# Altium schematic sheet AMC_FMC_Carrier_block.SchDoc
size A4; DocumentNumber: 2; SheetNumber: 2; SheetTotal: 30
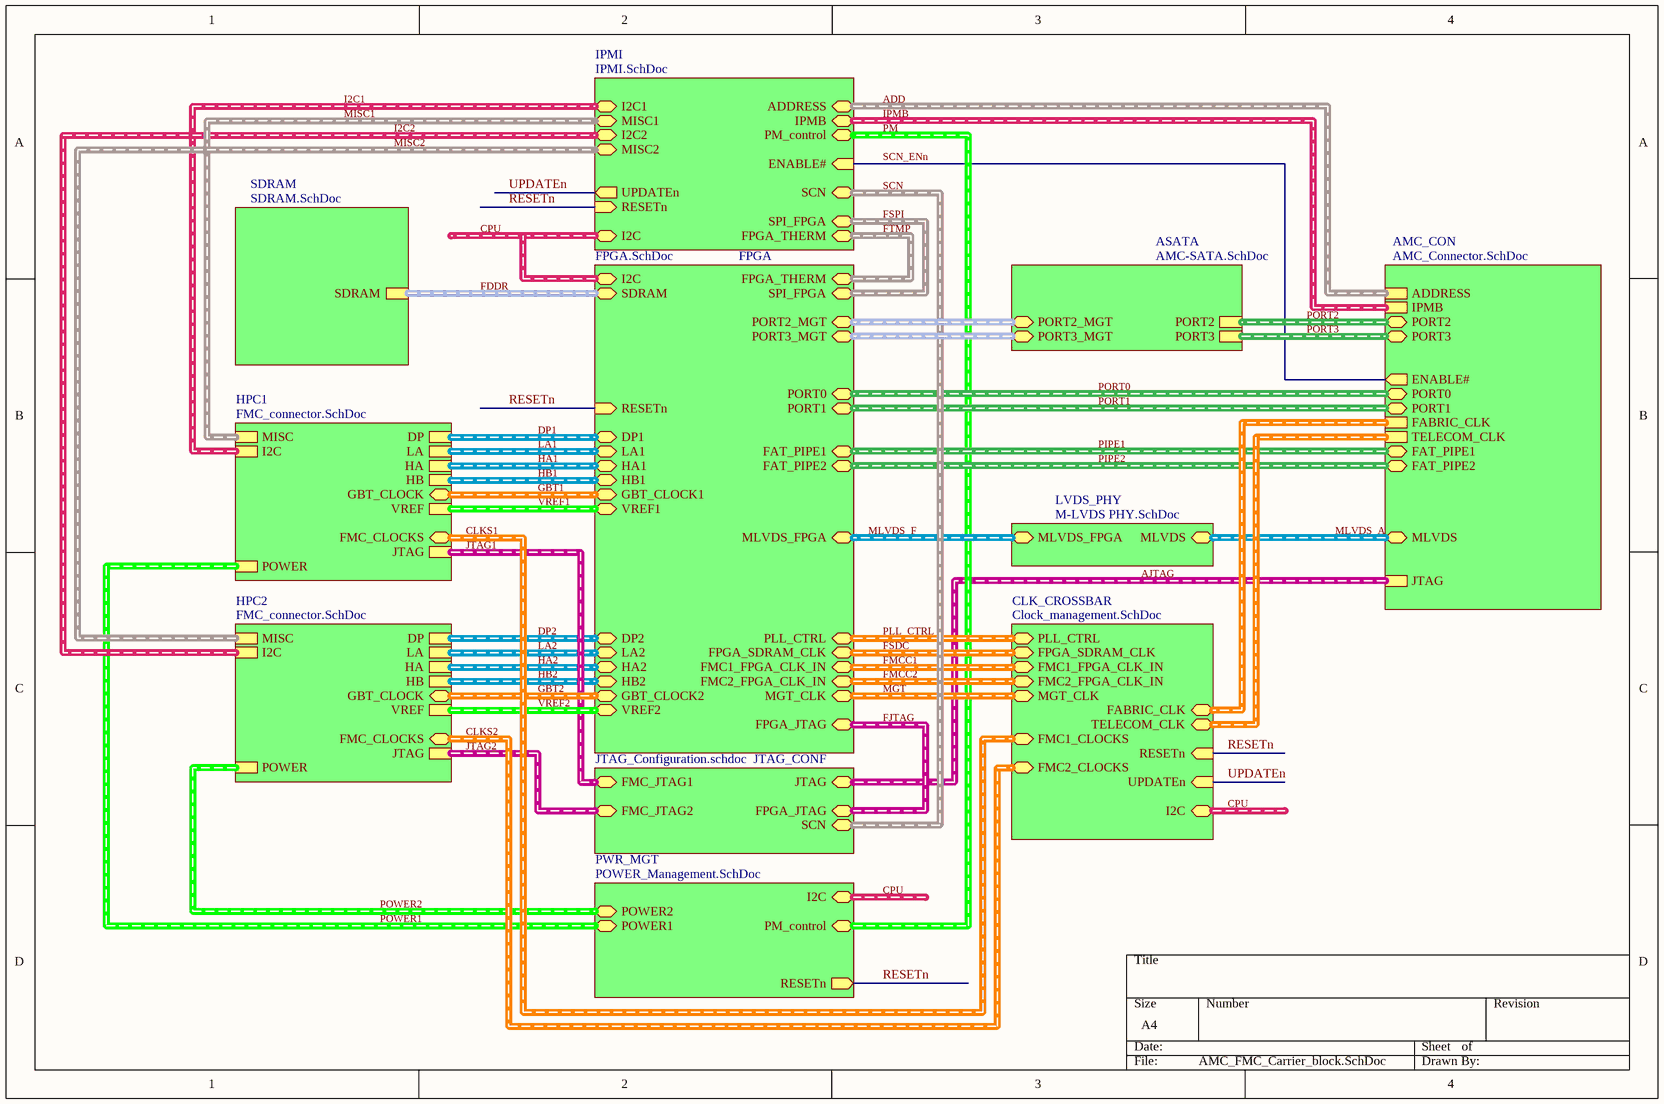
[diagram p0: AMC_FMC_Carrier_block.SchDoc]

## Sub-sheets
AMC_CON = AMC_Connector.SchDoc: JTAG (harness AMC_JTAG), TELECOM_CLK (harness AMC_TELECOM_CLOCK), ADDRESS (harness AMC_ADD), FABRIC_CLK (harness AMC_FABRIC_CLOCK), IPMB (harness I2C), ENABLE# (out), PORT0 (harness PORT0), PORT1 (harness PORT1), PORT2 (harness PORT2), PORT3 (harness PORT3), FAT_PIPE1 (harness FAT_PIPE1), FAT_PIPE2 (harness FAT_PIPE2), MLVDS (harness MLVDS)
ASATA = AMC-SATA.SchDoc: PORT2 (harness PORT2), PORT3 (harness PORT3), PORT2_MGT (harness PORT2), PORT3_MGT (harness PORT3)
CLK_CROSSBAR = Clock_management.SchDoc: FABRIC_CLK (harness AMC_FABRIC_CLOCK), TELECOM_CLK (harness AMC_TELECOM_CLOCK), FMC1_CLOCKS (harness FMC_CLOCKS), FMC2_CLOCKS (harness FMC_CLOCKS), MGT_CLK (harness MGT_CLK), FMC1_FPGA_CLK_IN (harness FMC_FPGA_CLK_IN), FMC2_FPGA_CLK_IN (harness FMC_FPGA_CLK_IN), FPGA_SDRAM_CLK (harness FPGA_SDRAM_CLK), PLL_CTRL (harness PLL_CTRL), RESETn (in), UPDATEn (in), I2C (harness I2C)
FPGA = FPGA.SchDoc: SDRAM (harness DDR), FPGA_JTAG (harness FMC_J1_JTAG), VREF2 (harness FMC_J1_VREF), VREF1 (harness FMC_J1_VREF), FPGA_THERM (harness FPGA_THERM), SPI_FPGA (harness SPI), FAT_PIPE1, FAT_PIPE2, PORT1, PORT0, MLVDS_FPGA, GBT_CLOCK1, GBT_CLOCK2, MGT_CLK, FMC1_FPGA_CLK_IN, FMC2_FPGA_CLK_IN, FPGA_SDRAM_CLK, PLL_CTRL (harness PLL_CTRL), RESETn (in), I2C (harness I2C), LA1, HA1, HB1, LA2, HA2, HB2, DP1, DP2, PORT2_MGT, PORT3_MGT
HPC1 = FMC_connector.SchDoc: DP (harness FMC_J1_DP), LA (harness FMC_J1_LA), HA (harness FMC_J1_HA), HB (harness FMC_J1_HB), MISC (harness MISC), POWER (harness FMC_J1_POWER), JTAG (harness FMC_J1_JTAG), I2C (harness I2C), VREF (harness FMC_J1_VREF), FMC_CLOCKS (harness FMC_CLOCKS), GBT_CLOCK (harness GBT_CLOCK)
HPC2 = FMC_connector.SchDoc: DP (harness FMC_J1_DP), LA (harness FMC_J1_LA), HA (harness FMC_J1_HA), HB (harness FMC_J1_HB), MISC (harness MISC), POWER (harness FMC_J1_POWER), JTAG (harness FMC_J1_JTAG), I2C (harness I2C), VREF (harness FMC_J1_VREF), FMC_CLOCKS (harness FMC_CLOCKS), GBT_CLOCK (harness GBT_CLOCK)
IPMI = IPMI.SchDoc: I2C1 (harness I2C), I2C2 (harness I2C), IPMB (harness I2C), ADDRESS (harness AMC_ADD), MISC1 (harness MISC), MISC2 (harness MISC), PM_control (harness pm_control), FPGA_THERM (harness FPGA_THERM), SPI_FPGA (harness SPI), ENABLE# (in), UPDATEn (out), RESETn (in), I2C (harness I2C), SCN (harness SCN)
JTAG_CONF = JTAG_Configuration.schdoc: FMC_JTAG1 (harness FMC_J1_JTAG), FMC_JTAG2 (harness FMC_J1_JTAG), JTAG (harness AMC_JTAG), FPGA_JTAG (harness FMC_J1_JTAG), SCN (harness SCN)
LVDS_PHY = M-LVDS PHY.SchDoc: MLVDS (harness MLVDS), MLVDS_FPGA (harness MLVDS-FPGA)
PWR_MGT = POWER_Management.SchDoc: POWER1 (harness FMC_J1_POWER), POWER2 (harness FMC_J1_POWER), PM_control (harness PM_control), RESETn (out), I2C (harness I2C)
SDRAM = SDRAM.SchDoc: SDRAM (harness DDR)

## Nets
RESETn: sheet FPGA/RESETn, sheet PWR_MGT/RESETn, sheet IPMI/RESETn, sheet CLK_CROSSBAR/RESETn
SCN_ENn: sheet AMC_CON/ENABLE#, sheet IPMI/ENABLE#
UPDATEn: sheet IPMI/UPDATEn, sheet CLK_CROSSBAR/UPDATEn

## Buses and harness runs
harness ADD = sheet AMC_CON/ADDRESS = sheet IPMI/ADDRESS
harness AJTAG = sheet AMC_CON/JTAG = sheet JTAG_CONF/JTAG
harness CLKS1 = sheet CLK_CROSSBAR/FMC1_CLOCKS = sheet HPC1/FMC_CLOCKS
harness CLKS2 = sheet CLK_CROSSBAR/FMC2_CLOCKS = sheet HPC2/FMC_CLOCKS
harness CPU = sheet CLK_CROSSBAR/I2C
harness CPU = sheet FPGA/I2C = sheet IPMI/I2C
harness CPU = sheet PWR_MGT/I2C
harness DP1 = sheet FPGA/DP1 = sheet HPC1/DP
harness DP2 = sheet FPGA/DP2 = sheet HPC2/DP
harness FDDR = sheet FPGA/SDRAM = sheet SDRAM/SDRAM
harness FJTAG = sheet FPGA/FPGA_JTAG = sheet JTAG_CONF/FPGA_JTAG
harness FMCC1 = sheet CLK_CROSSBAR/FMC1_FPGA_CLK_IN = sheet FPGA/FMC1_FPGA_CLK_IN
harness FMCC2 = sheet CLK_CROSSBAR/FMC2_FPGA_CLK_IN = sheet FPGA/FMC2_FPGA_CLK_IN
harness FSDC = sheet CLK_CROSSBAR/FPGA_SDRAM_CLK = sheet FPGA/FPGA_SDRAM_CLK
harness FSPI = sheet FPGA/SPI_FPGA = sheet IPMI/SPI_FPGA
harness FTMP = sheet FPGA/FPGA_THERM = sheet IPMI/FPGA_THERM
harness GBT1 = sheet FPGA/GBT_CLOCK1 = sheet HPC1/GBT_CLOCK
harness GBT2 = sheet FPGA/GBT_CLOCK2 = sheet HPC2/GBT_CLOCK
harness HA1 = sheet FPGA/HA1 = sheet HPC1/HA
harness HA2 = sheet FPGA/HA2 = sheet HPC2/HA
harness HB1 = sheet FPGA/HB1 = sheet HPC1/HB
harness HB2 = sheet FPGA/HB2 = sheet HPC2/HB
harness I2C1 = sheet HPC1/I2C = sheet IPMI/I2C1
harness I2C2 = sheet HPC2/I2C = sheet IPMI/I2C2
harness IPMB = sheet AMC_CON/IPMB = sheet IPMI/IPMB
harness JTAG1 = sheet HPC1/JTAG = sheet JTAG_CONF/FMC_JTAG1
harness JTAG2 = sheet HPC2/JTAG = sheet JTAG_CONF/FMC_JTAG2
harness LA1 = sheet FPGA/LA1 = sheet HPC1/LA
harness LA2 = sheet FPGA/LA2 = sheet HPC2/LA
harness MGT = sheet CLK_CROSSBAR/MGT_CLK = sheet FPGA/MGT_CLK
harness MISC1 = sheet HPC1/MISC = sheet IPMI/MISC1
harness MISC2 = sheet HPC2/MISC = sheet IPMI/MISC2
harness MLVDS_A = sheet AMC_CON/MLVDS = sheet LVDS_PHY/MLVDS
harness MLVDS_F = sheet FPGA/MLVDS_FPGA = sheet LVDS_PHY/MLVDS_FPGA
harness PIPE1 = sheet AMC_CON/FAT_PIPE1 = sheet FPGA/FAT_PIPE1
harness PIPE2 = sheet AMC_CON/FAT_PIPE2 = sheet FPGA/FAT_PIPE2
harness PLL_CTRL = sheet CLK_CROSSBAR/PLL_CTRL = sheet FPGA/PLL_CTRL
harness PM = sheet IPMI/PM_control = sheet PWR_MGT/PM_control
harness PORT0 = sheet AMC_CON/PORT0 = sheet FPGA/PORT0
harness PORT1 = sheet AMC_CON/PORT1 = sheet FPGA/PORT1
harness PORT2 = sheet AMC_CON/PORT2 = sheet ASATA/PORT2
harness PORT3 = sheet AMC_CON/PORT3 = sheet ASATA/PORT3
harness POWER1 = sheet HPC1/POWER = sheet PWR_MGT/POWER1
harness POWER2 = sheet HPC2/POWER = sheet PWR_MGT/POWER2
harness SCN = sheet IPMI/SCN = sheet JTAG_CONF/SCN
harness sheet AMC_CON/FABRIC_CLK = sheet CLK_CROSSBAR/FABRIC_CLK
harness sheet AMC_CON/TELECOM_CLK = sheet CLK_CROSSBAR/TELECOM_CLK
harness sheet ASATA/PORT2_MGT = sheet FPGA/PORT2_MGT
harness sheet ASATA/PORT3_MGT = sheet FPGA/PORT3_MGT
harness VREF1 = sheet FPGA/VREF1 = sheet HPC1/VREF
harness VREF2 = sheet FPGA/VREF2 = sheet HPC2/VREF